# EAGLE design pj7 (EAGLE 7.3.2)
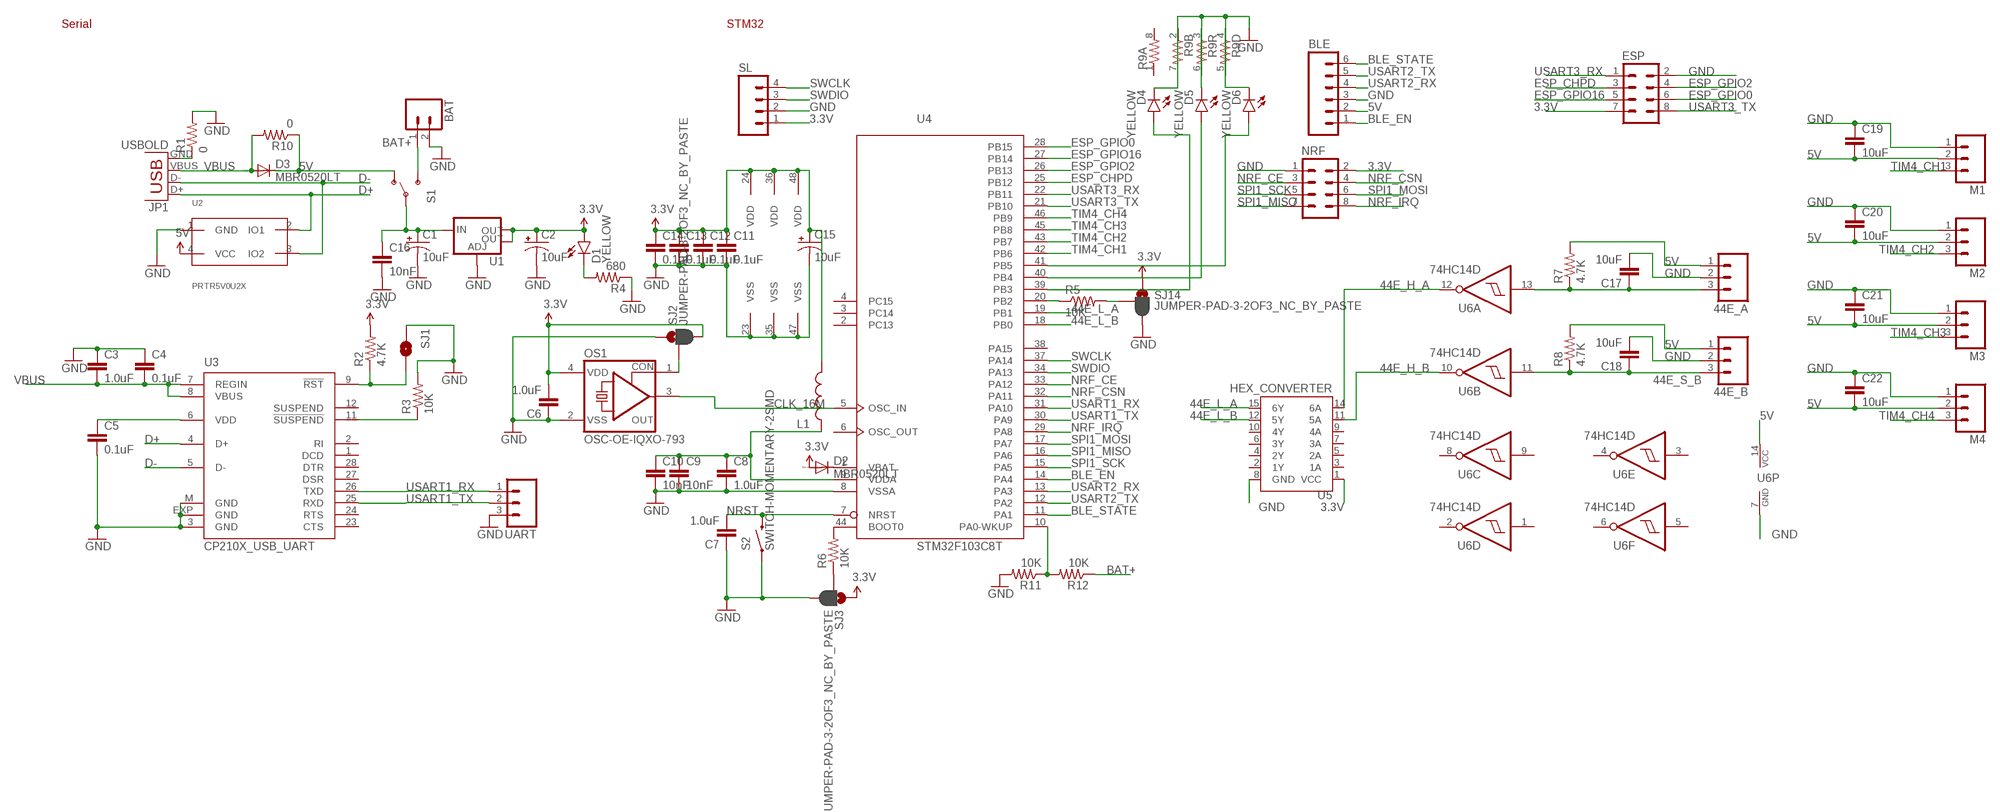
[diagram p0: schematic, sheet 1]

## Parts
44E_A  M03LOCK  [1X03_LOCK]
44E_B  M03LOCK  [1X03_LOCK]
BAT  M02LOCK  [1X02_LOCK]
BLE  M06LOCK  [1X06_LOCK]
C1  10uF  10UF-16V-10%(TANT)  [EIA3216]
C2  10uF  10UF-16V-10%(TANT)  [EIA3216]
C3  1.0uF  1.0UF-16V-10%(0603)  [0603-CAP]
C4  0.1uF  0.1UF-25V-5%(0603)  [0603-CAP]
C5  0.1uF  0.1UF-25V-5%(0603)  [0603-CAP]
C6  1.0uF  1.0UF-16V-10%(0603)  [0603-CAP]
C7  1.0uF  1.0UF-16V-10%(0603)  [0603-CAP]
C8  1.0uF  1.0UF-16V-10%(0603)  [0603-CAP]
C9  10nF  10NF/10000PF-50V-10%(0603)  [0603-CAP]
C10  10nF  10NF/10000PF-50V-10%(0603)  [0603-CAP]
C11  0.1uF  0.1UF-25V-5%(0603)  [0603-CAP]
C12  0.1uF  0.1UF-25V-5%(0603)  [0603-CAP]
C13  0.1uF  0.1UF-25V-5%(0603)  [0603-CAP]
C14  0.1uF  0.1UF-25V-5%(0603)  [0603-CAP]
C15  10uF  10UF-16V-10%(TANT)  [EIA3216]
C16  10nF  10NF/10000PF-50V-10%(0603)  [0603-CAP]
C17  10uF  10UF-6.3V-20%(0603)  [0603-CAP]
C18  10uF  10UF-6.3V-20%(0603)  [0603-CAP]
C19  10uF  10UF-6.3V-20%(0603)  [0603-CAP]
C20  10uF  10UF-6.3V-20%(0603)  [0603-CAP]
C21  10uF  10UF-6.3V-20%(0603)  [0603-CAP]
C22  10uF  10UF-6.3V-20%(0603)  [0603-CAP]
D1  YELLOW  LED-YELLOW1206  [LED-1206]
D2  MBR0520LT  [SOD123]
D3  MBR0520LT  [SOD123]
D4  YELLOW  LED-YELLOW1206  [LED-1206]
D5  YELLOW  LED-YELLOW1206  [LED-1206]
D6  YELLOW  LED-YELLOW1206  [LED-1206]
ESP  M04X2DIP  [2X4]
JP1  USBOLD  [USB-MINIB-OLD]
L1  INDUCTOR0603  [0603]
M1  M03LOCK  [1X03_LOCK]
M2  M03LOCK  [1X03_LOCK]
M3  M03LOCK  [1X03_LOCK]
M4  M03LOCK  [1X03_LOCK]
NRF  M04X2DIP  [2X4]
OS1  OSC-OE-IQXO-793  [2.5X2-4-PAD]
R1  0  0OHM-1/10W-5%(0603)  [0603]
R2  4.7K  4.7KOHM-1/10W-1%(0603)  [0603-RES]
R3  10K  4.7KOHM-1/10W-1%(0603)  [0603-RES]
R4  680  680OHM1/10W5%(0603)  [0603-RES]
R5  10K  10KOHM-1/10W-1%(0603)0603  [0603-RES]
R6  10K  10KOHM-1/10W-1%(0603)0603  [0603-RES]
R7  4.7K  4.7KOHM-1/10W-1%(0603)  [0603-RES]
R8  4.7K  4.7KOHM-1/10W-1%(0603)  [0603-RES]
R9  RESISTOR-ARRAY0603-ARV  [0603-ARV]
R10  0  0OHM-1/10W-5%(0603)  [0603]
R11  10K  10KOHM-1/10W-1%(0603)0603  [0603-RES]
R12  10K  10KOHM-1/10W-1%(0603)0603  [0603-RES]
S1  SWITCH-SPDTSMD  [AYZ0202]
S2  SWITCH-MOMENTARY-2SMD  [TACTILE-SWITCH-SMD]
SJ1  JUMPER-PAD-2-NOYES_SILK  [PAD-JUMPER-2-NO_YES_SILK]
SJ2  JUMPER-PAD-3-2OF3_NC_BY_PASTE  [PAD-JUMPER-3-2OF3_NC_BY_PASTE_YES_SILK_FULL_BOX]
SJ3  JUMPER-PAD-3-2OF3_NC_BY_PASTE  [PAD-JUMPER-3-2OF3_NC_BY_PASTE_YES_SILK_FULL_BOX]
SJ14  JUMPER-PAD-3-2OF3_NC_BY_PASTE  [PAD-JUMPER-3-2OF3_NC_BY_PASTE_YES_SILK_FULL_BOX]
SL  M04LOCK  [1X04_LOCK]
U1  V_REG_LM1117SOT223  [SOT223]
U2  PRTR5V0U2X  [SOT143]
U3  CP210X_USB_UART  [MLP28]
U4  STM32F103C8T  [LQFP48]
U5  HEX_CONVERTER  [SO016]
U6  74HC14D  [SO14]
UART  M03LOCK  [1X03_LOCK]

## Nets
3.3V: C2.A(+) C6.2 C11.1 C12.1 C13.1 C14.1 C15.A(+) D1.A D2.A ESP.7 L1.2 NRF.2 OS1.4(VDD) R2.2 SJ2.3 SJ3.1 SJ14.1 SL.1 U1.2(OUT) U1.4(OUT) U4.24(VDD) U4.36(VDD) U4.48(VDD) U5.1(VCC)
5V: 44E_A.1 44E_B.1 BLE.2 C19.2 C20.2 C21.2 C22.2 D3.C M1.2 M2.2 M3.2 M4.2 R7.2 R8.2 R10.1 S1.1(O) U2.4(VCC) U6.14(P:VCC)
44E_H_A: U5.14(6A) U6.12(A:O)
44E_H_B: U5.11(5A) U6.10(B:O)
44E_L_A: U4.19(PB1) U5.15(6Y)
44E_L_B: U4.18(PB0) U5.12(5Y)
44E_S_B: 44E_B.3 C18.1 R8.1 U6.11(B:I)
BAT+: BAT.1 R12.1 S1.3(S)
BLE_EN: BLE.1 U4.14(PA4)
BLE_STATE: BLE.6 U4.11(PA1)
CLK_16M: OS1.3(OUT) U4.5(OSC_IN)
D+: JP1.D+ U2.2(IO1) U3.4(D+)
D-: JP1.D- U2.3(IO2) U3.5(D-)
ESP_CHPD: ESP.3 U4.25(PB12)
ESP_GPIO0: ESP.6 U4.28(PB15)
ESP_GPIO2: ESP.4 U4.26(PB13)
ESP_GPIO16: ESP.5 U4.27(PB14)
GND: 44E_A.2 44E_B.2 BAT.2 BLE.3 C1.C(-) C2.C(-) C3.1 C4.1 C5.2 C6.1 C7.1 C8.2 C9.2 C10.2 C11.2 C12.2 C13.2 C14.2 C15.C(-) C16.2 C17.2 C18.2 C19.1 C20.1 C21.1 C22.1 ESP.2 M1.1 M2.1 M3.1 M4.1 NRF.1 OS1.2(VSS) R1.2 R3.2 R4.1 R9.5 R9.6 R9.7 R11.2 S2.1 SJ1.2 SJ2.1 SJ3.3 SJ14.3 SL.2 U1.1(ADJ) U2.1(GND) U3.3(GND) U3.EXP(GND) U3.M(GND) U4.8(VSSA) U4.23(VSS) U4.35(VSS) U4.47(VSS) U5.8(GND) U6.7(P:GND) UART.3
N$1: JP1.GND R1.1
N$2: R3.1 U3.11(!SUSPEND)
N$3: D1.C R4.2
N$4: D2.C U4.1(VBAT)
N$5: R11.1 R12.2 U4.10(PA0-WKUP)
N$6: C8.1 C9.1 C10.1 L1.1 U4.9(VDDA)
N$7: R6.2 U4.44(BOOT0)
N$8: D6.A U4.41(PB5)
N$9: R6.1 SJ3.2
N$10: R2.1 SJ1.1 U3.9(!RST)
N$11: OS1.1(CON) SJ2.2
N$13: D5.A U4.40(PB4)
N$14: 44E_A.3 C17.1 R7.1 U6.13(A:I)
N$15: C5.1 U3.6(VDD)
N$16: D4.A U4.39(PB3)
N$17: D4.C R9.2
N$18: D5.C R9.3
N$19: D6.C R9.4
N$20: C1.A(+) C16.1 S1.2(P) U1.3(IN)
N$48: R5.2 SJ14.2
NRF_CE: NRF.3 U4.33(PA12)
NRF_CSN: NRF.4 U4.32(PA11)
NRF_IRQ: NRF.8 U4.29(PA8)
NRST: C7.2 S2.3 U4.7(NRST)
OURET: R5.1 U4.20(PB2)
SPI1_MISO: NRF.7 U4.16(PA6)
SPI1_MOSI: NRF.6 U4.17(PA7)
SPI1_SCK: NRF.5 U4.15(PA5)
SWCLK: SL.4 U4.37(PA14)
SWDIO: SL.3 U4.34(PA13)
TIM4_CH1: M1.3 U4.42(PB6)
TIM4_CH2: M2.3 U4.43(PB7)
TIM4_CH3: M3.3 U4.45(PB8)
TIM4_CH4: M4.3 U4.46(PB9)
USART1_RX: U3.26(TXD) U4.31(PA10) UART.1
USART1_TX: U3.25(RXD) U4.30(PA9) UART.2
USART2_RX: BLE.4 U4.13(PA3)
USART2_TX: BLE.5 U4.12(PA2)
USART3_RX: ESP.1 U4.22(PB11)
USART3_TX: ESP.8 U4.21(PB10)
VBUS: C3.2 C4.2 D3.A JP1.VBUS R10.2 U3.7(REGIN) U3.8(VBUS)
Unconnected: R9.1 R9.8 U3.1(DCD) U3.2(RI) U3.12(SUSPEND) U3.23(CTS) U3.24(RTS) U3.27(DSR) U3.28(DTR) U4.2(PC13) U4.3(PC14) U4.4(PC15) U4.6(OSC_OUT) U4.38(PA15) U5.2(1Y) U5.3(1A) U5.4(2Y) U5.5(2A) U5.6(3Y) U5.7(3A) U5.9(4A) U5.10(4Y) U6.1(D:I) U6.2(D:O) U6.3(E:I) U6.4(E:O) U6.5(F:I) U6.6(F:O) U6.8(C:O) U6.9(C:I)

## Notes on the sheet
- Serial | STM32

## Library data of the parts
44E_A 44E_B M1-M4 UART = SparkFun-Connectors:M03: Header 3 Standard 3-pin 0.1" header. Use with straight break away headers (SKU : PRT-00116), right angle break away headers (PRT-00553), swiss pins (PRT-00743), machine pins (PRT-00117), and female headers (PRT-00115). Molex polarized connector foot print use with SKU : PRT-08232 with associated crimp pins and housings.
BAT = SparkFun-Connectors:M02: Standard 2-pin 0.1" header. Use with - straight break away headers ( PRT-00116) - right angle break away headers (PRT-00553) - swiss pins (PRT-00743) - machine pins (PRT-00117) - female headers (PRT-00115) Molex polarized connector foot print use with: PRT-08233 with associated crimp pins and housings. 2.54_SCREWTERM for use with PRT-10571. 3.5mm Screw Terminal footprints for PRT-08084 5mm Screw Terminal footprints for use with PRT-08432
BLE = SparkFun-Connectors:M06: Header 6 Standard 6-pin 0.1" header. Use with straight break away headers (SKU : PRT-00116), right angle break away headers (PRT-00553), swiss pins (PRT-00743), machine pins (PRT-00117), and female headers (PRT-00115). Molex polarized connector foot print use with SKU : PRT-08094 with associated crimp pins and housings. NOTES ON THE VARIANTS LOCK and LOCK_LONGPADS... This footprint was designed to help hold the alignment of a through-hole component (i.e. 6-pin header) while soldering it into place. You may notice that each hole has been shifted either up or down by 0.005 of an inch from it's more standard position (which is a perfectly straight line). This slight alteration caused the pins (the squares in the middle) to touch the edges of the holes. Because they are alternating, it causes a "brace" to hold the component in place. 0.005 has proven to be the perfect amount of "off-center" position when using our standard breakaway headers. Although looks a little odd when you look at the bare footprint, once you have a header in there, the alteration is very hard to notice. Also,if you push a header all the way into place, it is covered up entirely on the bottom side. This idea of altering the position of holes to aid alignment will be further integrated into the Sparkfun Library for other footprints. It can help hold any component with 3 or more connection pins.
C1 C2 C15 = SparkFun-Capacitors:10UF-16V-10%(TANT): CAP-00811 1206/EIA-3216 Tantalum capacitor; PROD_ID: CAP-00811
C3 C6-C8 = SparkFun-Capacitors:1.0UF-16V-10%(0603): CAP-00868; PROD_ID: CAP-00868
C4 C5 C11-C14 = SparkFun-Capacitors:0.1UF-25V-5%(0603): CAP-08604; PROD_ID: CAP-08604
C9 C10 C16 = SparkFun-Capacitors:10NF/10000PF-50V-10%(0603): CAP-00867; PROD_ID: CAP-00867
C17-C22 = SparkFun-Capacitors:10UF-6.3V-20%(0603): CAP-11015; PROD_ID: CAP-11015
D1 D4-D6 = SparkFun-LED:LED-YELLOW: Yellow SMD LEDs LilyPad 1206- DIO-09909 0603- DIO-09003 "SMART" means more efficient and expensive; PROD_ID: DIO-00820
D2 D3 = diode:MBR0520LT: SCHOTTKY BARRIER RECTIFIER Source: http://onsemi.com .. MBR0520LT1-D.pdf
ESP NRF = SparkFun-Connectors:M04X2: .1" header, two rows of four.
JP1 = SparkFun-Connectors:USB: USB Connectors USB-B-PTH is fully proven SKU : PRT-00139/CONN-08278 USB-miniB is fully proven SKU : PRT-00587 USB-A-PCB is untested. USB-A-H is throughly reviewed, but untested. Spark Fun Electronics SKU : PRT-00437 USB-B-SMT is throughly reviewed, but untested. Needs silkscreen touching up. USB-A-S has not been used/tested USB-MB-H has not been used/tested USB-MICROB has been used. CONN-09505
L1 = SparkFun-Passives:INDUCTOR: Inductors Basic Inductor/Choke - 0603 and 1206. Footprints are not proven and vary greatly between part numbers. INDUCTOR POWER 3.3UH 4.0A SMD 0.197" L x 0.197" W x 0.177" H (5.00mm x 5.00mm x 4.50mm)
OS1 = IQD-Frequency-Products:OSC-OE: OSCILLATOR WITH OE
R1 R10 = SparkFun-Resistors:0OHM-1/10W-5%(0603): RES-08609; PROD_ID: RES-08609
R2 R7 R8 = SparkFun-Resistors:4.7KOHM-1/10W-1%(0603): RES-07857; PROD_ID: RES-07857
R3 = SparkFun-Resistors:4.7KOHM-1/10W-1%(0603): RES-07857; PROD_ID: RES-07857; VALUE: 4.7K
R4 = SparkFun-Resistors:680OHM1/10W5%(0603): RES-09333; PROD_ID: RES-09333
R5 R6 R11 R12 = SparkFun-Resistors:10KOHM-1/10W-1%(0603): RES-00824; PROD_ID: RES-00824
R9 = SparkFun-Resistors:RESISTOR-ARRAY: Array Chip Resistor Source: RS Component / Phycomp
S1 = SparkFun-Electromechanical:SWITCH-SPDT: SPDT Switch Simple slide switch, Spark Fun Electronics SKU : COM-00102 DPDT SMT slide switch, AYZ0202, SWCH-08179; PROD_ID: SWCH-08179; SF_ID: COM-00597
S2 = SparkFun-Electromechanical:SWITCH-MOMENTARY-2: Various NO switches- pushbuttons, reed, etc; PROD_ID: SWCH-08247
SJ1 = SparkFun-Passives:JUMPER-PAD-2-NO
SJ2 SJ3 SJ14 = SparkFun-Passives:JUMPER-PAD-3-2OF3_NC_BY_PASTE
SL = SparkFun-Connectors:M04: Header 4 Standard 4-pin 0.1" header. Use with straight break away headers (SKU : PRT-00116), right angle break away headers (PRT-00553), swiss pins (PRT-00743), machine pins (PRT-00117), and female headers (PRT-00115). Molex polarized connector foot print use with SKU : PRT-08231 with associated crimp pins and housings. 1MM SMD Version SKU: PRT-10208
U1 = SparkFun-PowerIC:V_REG_LM1117: Voltage Regulator LM1117 Standard adjustable voltage regulator but in SMD form. Spark Fun Electronics SKU : COM-00595; PROD_ID: VREG-08170
U2 = semicon-smd-ipc:PRTR5V0U2X
U3 = SparkFun-DigitalIC:CP210X_USB_UART: Single-Chip USB to UART Bridge Source: www.silabs.com .. CP2101.pdf / cp2102.pdf. Spark Fun Electronics SKU : COM-00310
U4 = micro-stm_v3:STM32F103C*T: ARM 32-bit Cortex™-M3 CPU 72 MHz maximum frequency 16 to 128 Kbytes of Flash memory 6 to 20 kbytes of SRAM 37 GPIOs 2.0 to 3.6 V application supply
U5 = SparkFun-DigitalIC:HEX_CONVERTER: 74HC4050 Hex Buffer Level Shifter SMD SO016; PROD_ID: IC-09604
U6 = 74xx-eu:74*14: Hex schmitt trigger INVERTER

## Board
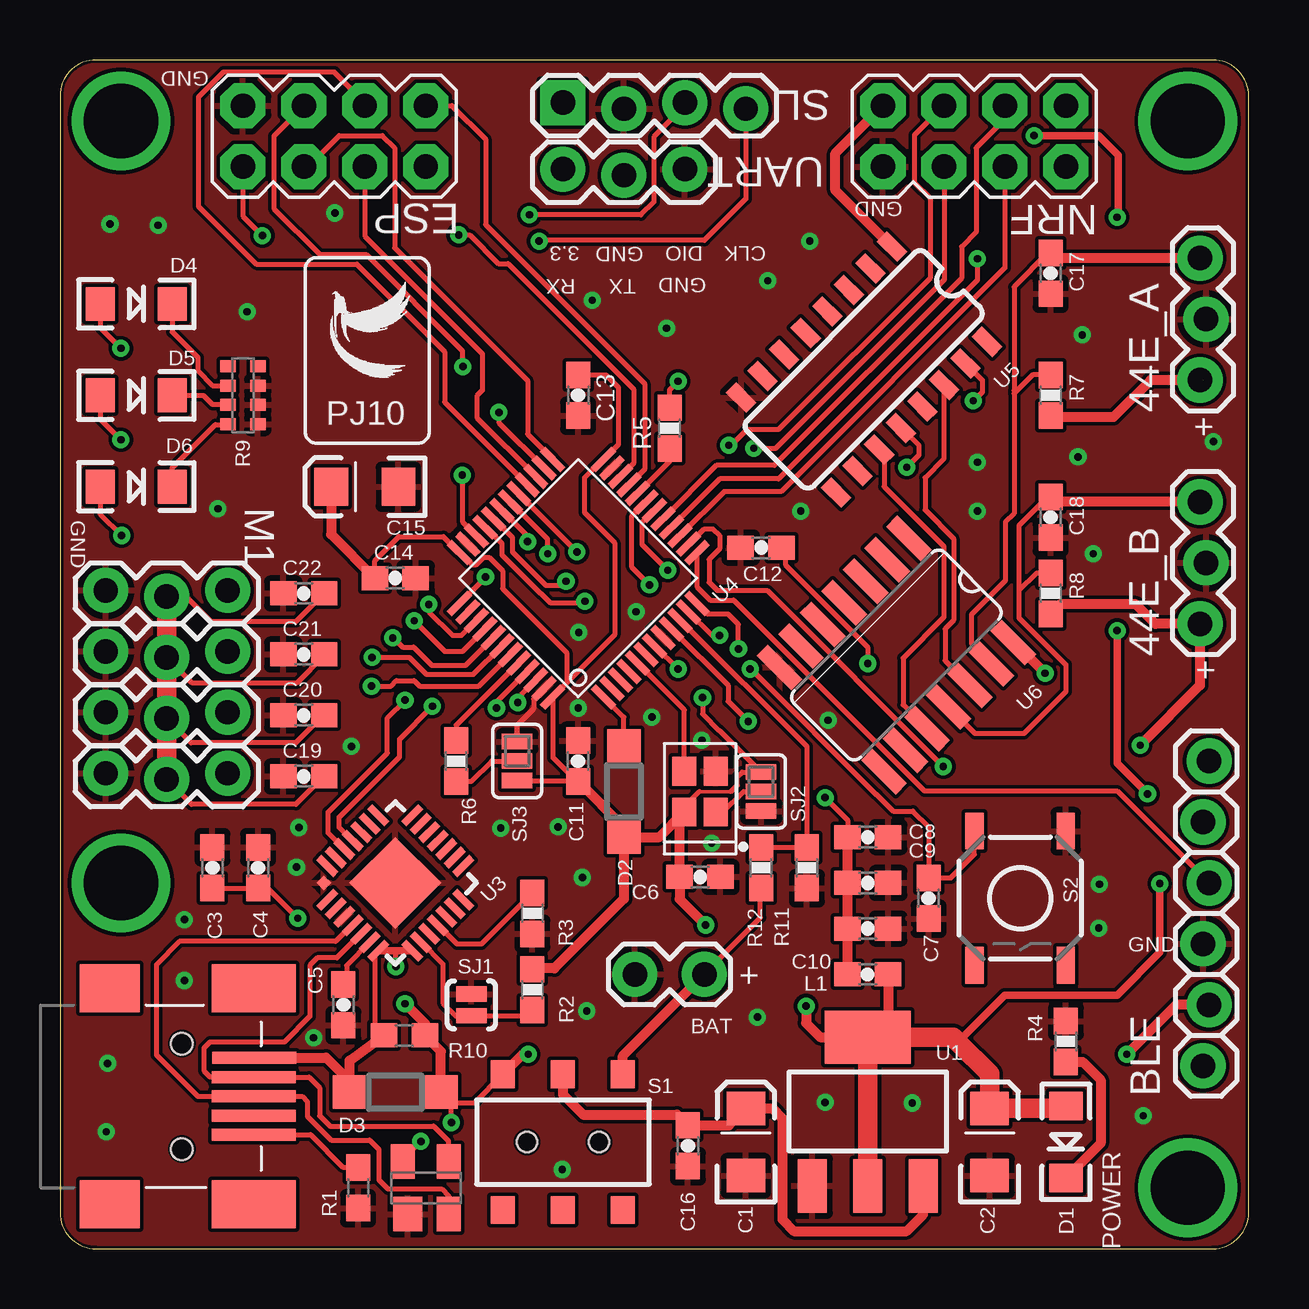
[diagram p1: board, top side]
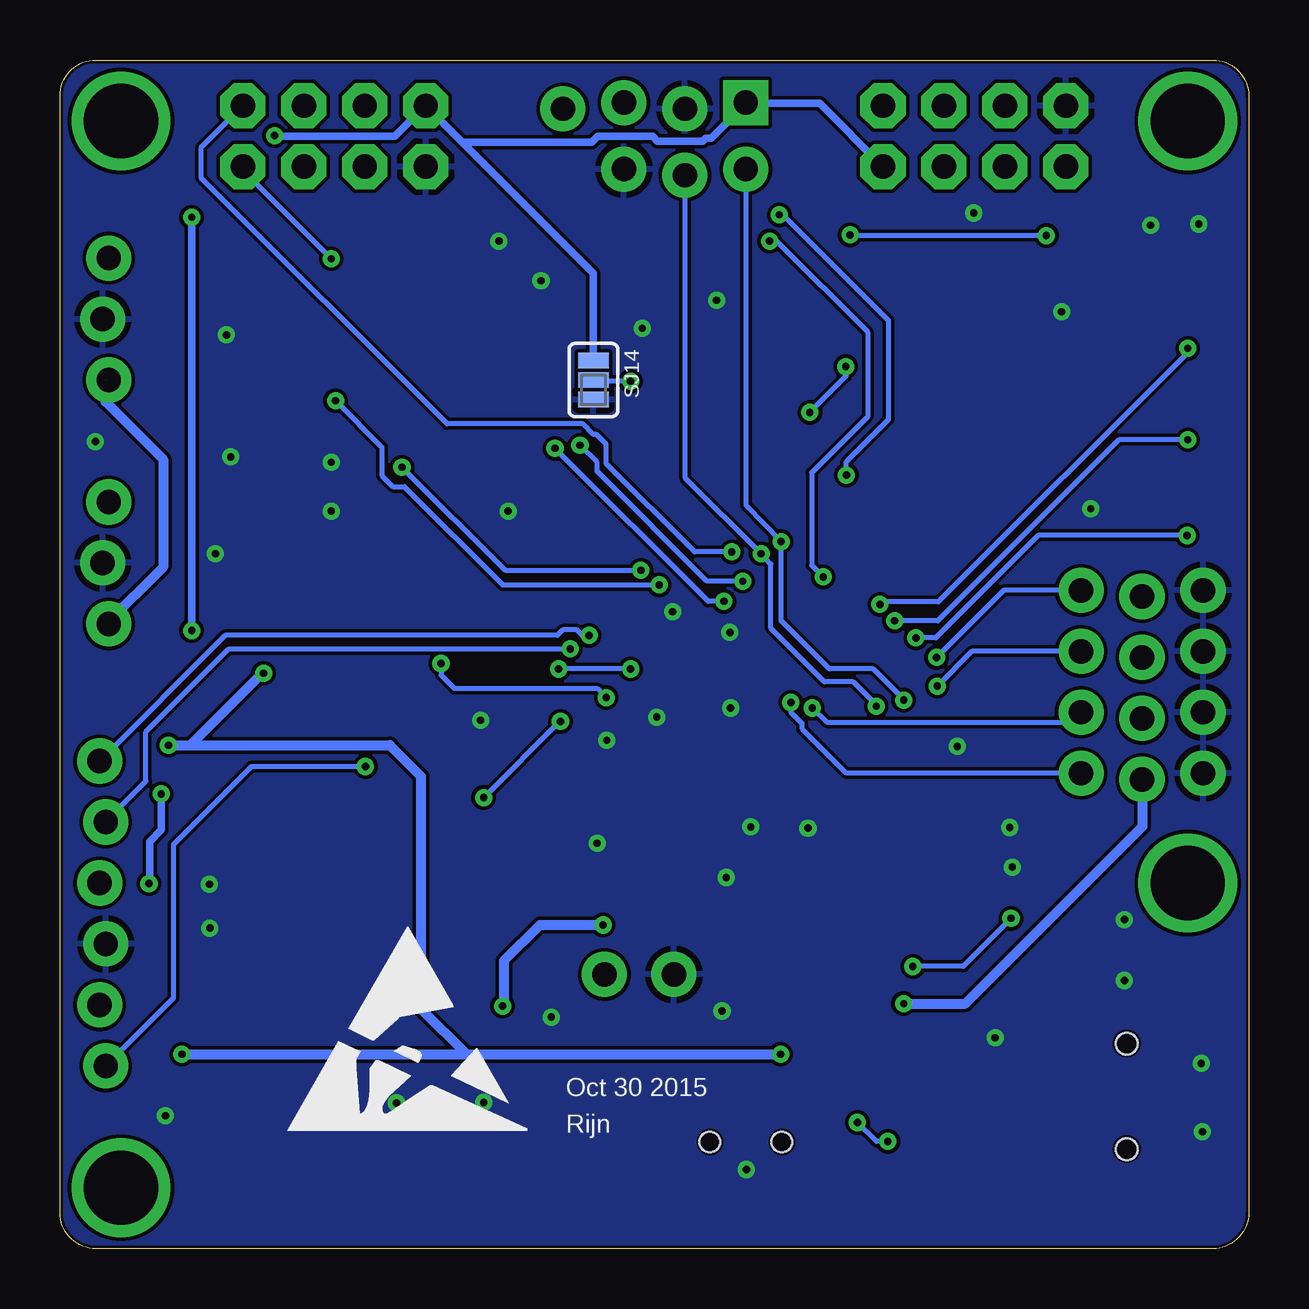
[diagram p2: board, bottom side, seen from below]

Size 49.53 x 49.53 mm. Coordinates in mm from the lower left corner, seen from the top.
Outline: 0,48.03 0,1.5 arc90 1.5,0 48.03,0 arc90 49.53,1.5 49.53,48.03 arc90 48.03,49.53 1.5,49.53 arc90 0,48.03
Copper layers (1*16): Top 0.035mm / dielectric 1.5mm / Bottom 0.035mm
Design rules "default *": minimum track width 6mil, minimum drill 12mil, track to track 6mil, track to pad 6mil, pad to pad 6mil, via to via 6mil, smd to smd 6mil, copper to edge 5mil, drill to drill 6mil, minimum pad ring 10mil, minimum via ring 8mil, stop-mask expansion 0mil, vias tented up to drill 15mil, thermal gap 10mil

### Footprints (pad centres in the part's own frame; a part is rotated, then mirrored left to right if it is on the bottom)
1X03_LOCK = drill 1.016 pad 1.88: 1 0,0.127; 2 2.54,-0.127; 3 5.08,0.127
1X02_LOCK = drill 1.016 pad 1.88: 1 -0.178,0; 2 2.718,0
1X06_LOCK = drill 1.016 pad 1.88: 1 0,0; 2 2.54,-0.254; 3 5.08,0; 4 7.62,-0.254; 5 10.16,0; 6 12.7,-0.254
EIA3216 = smd 1.4 x 1.6: A 1.4,0; C -1.4,0
0603-CAP = smd 1.1 x 1: 1 -0.85,0; 2 0.85,0
LED-1206 = smd 1.2 x 1.4: A -1.5,0; C 1.5,0
SOD123 = smd 1.4 x 1.4: A 1.9,0; C -1.9,0
2X4 = drill 1.016 pad 1.88 octagon: 1 -3.81,-1.27; 2 -3.81,1.27; 3 -1.27,-1.27; 4 -1.27,1.27; 5 1.27,-1.27; 6 1.27,1.27; 7 3.81,-1.27; 8 3.81,1.27
USB-MINIB-OLD = smd 2.5 x 2: 1 -3,-4.5; 2 -3,4.5 | smd 3.5 x 2: 3 3,-4.5; 4 3,4.5 | smd 3.5 x 0.5: D+ 3,0; D- 3,0.8; GND 3,-1.6; ID 3,-0.8; VBUS 3.01,1.61 | hole 0.9: 0,2.2; 0,-2.2
0603 = smd 1.1 x 1: 1 -0.85,0; 2 0.85,0
2.5X2-4-PAD = smd 1.2 x 1: 1 -0.85,-0.65; 2 0.85,-0.65; 3 0.85,0.65; 4 -0.85,0.65
0603-RES = smd 1.1 x 1: 1 -0.85,0; 2 0.85,0
0603-ARV = smd 0.5 x 0.65: 1 -1.2,-0.625; 2 -0.4,-0.625; 3 0.4,-0.625; 4 1.2,-0.625; 5 1.2,0.625; 6 0.4,0.625; 7 -0.4,0.625; 8 -1.2,0.625
AYZ0202 = smd 1 x 1.15: 1 -2.5,2.825; 2 0,2.825; 3 2.5,2.825; 4 -2.5,-2.825; 5 0,-2.825; 6 2.5,-2.825 | hole 0.85: 1.5,0; -1.5,0
TACTILE-SWITCH-SMD = smd 1.524 x 0.762: 1 -2.794,1.905; 2 2.794,1.905; 3 -2.794,-1.905; 4 2.794,-1.905
PAD-JUMPER-2-NO_YES_SILK = smd 0.635 x 1.27: 1 -0.45,0; 2 0.45,0
PAD-JUMPER-3-2OF3_NC_BY_PASTE_YES_SILK_FULL_BOX = smd 0.635 x 1.27: 1 -0.813,0; 2 0,0; 3 0.813,0
1X04_LOCK = drill 1.016 pad 1.88 square: 1 0,0.127 | drill 1.016 pad 1.88: 2 2.54,-0.127; 3 5.08,0.127; 4 7.62,-0.127
SOT223 = smd 1.219 x 2.235: 1 -2.311,-3.099; 2 0,-3.099; 3 2.311,-3.099 | smd 3.6 x 2.2: 4 0,3.099
SOT143 = smd 1.2 x 1.44: 1 -0.75,-1.1 | smd 1 x 1.44: 2 0.95,-1.1; 3 0.95,1.1; 4 -0.95,1.1
MLP28 = smd 1 x 0.3: 1 -2.5,1.5; 2 -2.5,1; 3 -2.5,0.5; 4 -2.5,0; 5 -2.5,-0.5; 6 -2.5,-1; 7 -2.5,-1.5; 15 2.5,-1.5; 16 2.5,-1; 17 2.5,-0.5; 18 2.5,0; 19 2.5,0.5; 20 2.5,1; 21 2.5,1.5 | smd 0.3 x 1: 8 -1.5,-2.5; 9 -1,-2.5; 10 -0.5,-2.5; 11 0,-2.5; 12 0.5,-2.5; 13 1,-2.5; 14 1.5,-2.5; 22 1.5,2.5; 23 1,2.5; 24 0.5,2.5; 25 0,2.5; 26 -0.5,2.5; 27 -1,2.5; 28 -1.5,2.5 | smd 2.7 x 2.7: EXP 0,0 | smd 0.435 x 0.435: M -2.103,2.103
LQFP48 = smd 0.3 x 1.2: 1 -2.75,-4.25; 2 -2.25,-4.25; 3 -1.75,-4.25; 4 -1.25,-4.25; 5 -0.75,-4.25; 6 -0.25,-4.25; 7 0.25,-4.25; 8 0.75,-4.25; 9 1.25,-4.25; 10 1.75,-4.25; 11 2.25,-4.25; 12 2.75,-4.25; 25 2.75,4.25; 26 2.25,4.25; 27 1.75,4.25; 28 1.25,4.25; 29 0.75,4.25; 30 0.25,4.25; 31 -0.25,4.25; 32 -0.75,4.25; 33 -1.25,4.25; 34 -1.75,4.25; 35 -2.25,4.25; 36 -2.75,4.25 | smd 1.2 x 0.3: 13 4.25,-2.75; 14 4.25,-2.25; 15 4.25,-1.75; 16 4.25,-1.25; 17 4.25,-0.75; 18 4.25,-0.25; 19 4.25,0.25; 20 4.25,0.75; 21 4.25,1.25; 22 4.25,1.75; 23 4.25,2.25; 24 4.25,2.75; 37 -4.25,2.75; 38 -4.25,2.25; 39 -4.25,1.75; 40 -4.25,1.25; 41 -4.25,0.75; 42 -4.25,0.25; 43 -4.25,-0.25; 44 -4.25,-0.75; 45 -4.25,-1.25; 46 -4.25,-1.75; 47 -4.25,-2.25; 48 -4.25,-2.75
SO016 = smd 0.6 x 1.2: 1 -4.445,-2.8; 2 -3.175,-2.8; 3 -1.905,-2.8; 4 -0.635,-2.8; 5 0.635,-2.8; 6 1.905,-2.8; 7 3.175,-2.8; 8 4.445,-2.8; 9 4.445,2.8; 10 3.175,2.8; 11 1.905,2.8; 12 0.635,2.8; 13 -0.635,2.8; 14 -1.905,2.8; 15 -3.175,2.8; 16 -4.445,2.8
SO14 = smd 0.66 x 2.032: 1 -3.81,-3.073; 2 -2.54,-3.073; 3 -1.27,-3.073; 4 0,-3.073; 5 1.27,-3.073; 6 2.54,-3.073; 7 3.81,-3.073; 8 3.81,3.073; 9 2.54,3.073; 10 1.27,3.073; 11 0,3.073; 12 -1.27,3.073; 13 -2.54,3.073; 14 -3.81,3.073

### Placement (x,y rotation side)
44E_A  47.62,36.2 90 top
44E_B  47.62,26.04 90 top
BAT  26.67,11.43 180 top
BLE  47.62,7.62 90 top
C1  28.57,4.45 90 top
C2  38.73,4.45 90 top
C3  6.35,15.88 270 top
C4  8.26,15.88 270 top
C5  11.81,10.16 270 top
C6  26.67,15.49 180 top
C7  36.2,14.61 90 top
C8  33.66,17.14 0 top
C9  33.66,15.24 0 top
C10  33.66,13.34 0 top
C11  21.59,20.32 90 top
C12  29.21,29.21 180 top
C13  21.59,35.56 270 top
C14  13.97,27.94 0 top
C15  12.7,31.75 180 top
C16  26.16,4.29 270 top
C17  41.27,40.64 270 top
C18  41.27,30.48 270 top
C19  10.16,19.68 0 top
C20  10.16,22.23 0 top
C21  10.16,24.77 0 top
C22  10.16,27.3 0 top
D1  41.91,4.45 270 top
D2  23.5,19.05 270 top
D3  13.97,6.53 180 top
D4  3.17,39.37 0 top
D5  3.17,35.56 0 top
D6  3.17,31.75 0 top
ESP  11.43,46.35 0 top
JP1  5.08,6.35 0 top
L1  33.66,11.43 0 top
M1  1.91,27.3 0 top
M2  1.91,24.77 0 top
M3  1.91,22.23 0 top
M4  1.91,19.68 0 top
NRF  38.1,46.35 0 top
OS1  26.67,19.05 90 top
R1  12.42,2.54 270 top
R2  19.68,10.79 90 top
R3  19.68,13.97 270 top
R4  41.91,8.64 270 top
R5  25.4,34.19 90 top
R6  16.51,20.32 90 top
R7  41.27,35.56 270 top
R8  41.27,27.3 270 top
R9  7.62,35.56 270 top
R10  14.35,8.89 180 top
R11  31.11,15.88 270 top
R12  29.21,15.88 90 top
S1  20.95,4.45 0 top
S2  40.01,14.61 270 top
SJ1  17.14,10.16 90 top
SJ2  29.21,19.05 90 top
SJ3  19.05,20.32 90 top
SJ14  27.3,36.2 270 bottom
SL  20.95,47.62 0 top
U1  33.66,5.71 0 top
U2  15.24,2.54 0 top
U3  13.97,15.24 45 top
U4  21.59,27.94 45 top
U5  33.5,36.63 225 top
U6  34.85,24.74 225 top
U$1  [LOGO]  11.25,36.27 0 top
U$2  [ESD_10.00]  40.13,4.83 0 bottom
UART  20.95,44.86 0 top

### Tracks (layer width: path | path; a pad name or v marks a point on that pad's centre or on a via)
3.3V  (via drill 0.3)
  Top 0.152: 26.64,19.05 27.94,19.05
  Top 0.203: U4.48 20.55,22.97 20.55,20.45 21.53,19.47 C11.1 19.09,19.47 SJ3.1 | C14.1 13.12,28.66 14.12,29.67 15.97,29.67 U4.36 16.67,29 17.17,28.5 17.35,28.5 17.65,28.8 17.88,28.8 18.44,28.25 18.44,27.51 21.11,24.84 21.11,23.57 U4.48 | C13.1 22.75,36.41 23.27,35.89 23.27,33.51 U4.24 22.6,32.89 21.84,32.13 21.84,30.68 23.11,29.41 23.11,25.57 U4.48 | OS1.4 26.02,18.4 26.64,19.05 | 27.94,19.05 28.22,19.3 28.22,19.66 28.42,19.86 SJ2.3 27.48,21.59 27.46,21.59 26.77,22.28 v26.77,22.96 | C12.1 30.15,29.21 30.23,29.13 30.23,28.5 33.66,25.07 v33.66,24.38
  Top 0.305: v40.59,46.38 43.28,46.38 44.09,45.57 44.09,43.03 v44.04,42.98 | v44.04,25.76 44.04,20.22 v45.31,18.95 | v45.82,15.21 45.82,12.34 44.04,10.57 39.37,10.57 37.41,8.61
  Top 0.406: L1.2 34.51,9.66 U1.4 | v26.9,13.49 25.82,14.57 C6.2 25.82,18 OS1.4 24.97,17.15 D2.A | v31.09,10.11 31.09,9.4 31.67,8.81 U1.4 | U1.4 | D2.A 23.5,17.57 C11.1 | D2.A 23.5,14.58 20.6,11.68 19.72,11.68 R2.2 | C15.A 11.3,29.76 C14.1 | U5.1 34.65,41.75 32.31,44.09 32.31,45.64 NRF.2
  Top 0.813: U1.4 U1.2 | U1.4 37.21,8.81 37.41,8.61 38.73,7.29 C2.A 41.81,5.84 D1.A | U1.4
  Bottom 0.203: v33.66,24.38 33.66,23.9 33.1,23.34 27.15,23.34 v26.77,22.96
  Bottom 0.305: SL.1 20.95,47.73 | 20.95,47.73 22.4,46.28 22.63,46.28 22.76,46.15 24.64,46.15 24.84,46.35 27.13,46.35 27.38,46.1 32.77,46.1 | 32.77,46.1 34.27,47.6 | 20.95,47.73 17.88,47.73 ESP.7 | 34.27,47.6 34.34,47.6 35.59,46.35 40.56,46.35 v40.59,46.38 | v44.04,42.98 v44.04,25.76 | v45.31,18.95 45.31,17.45 45.8,16.97 45.8,15.24 v45.82,15.21 | SJ14.1 27.3,40.64 32.77,46.1 | 34.27,47.6 NRF.2
  Bottom 0.406: v26.9,13.49 29.54,13.49 31.04,11.99 31.04,10.16 v31.09,10.11
5V  (via drill 0.3)  (1 unrouted)
  Top 0.203: U2.4 14.29,3.72 v15.04,4.47 | 16.31,5.91 D3.C 16.31,6.09 | M1.2 5.23,27.18 6.27,26.14 9.84,26.14 C22.2 | C21.2 11.01,24.73 9.86,23.57 5.51,23.57 M2.2 | C20.2 10.97,22.23 9.83,21.08 5.46,21.08 M3.2 | C19.2 11,19.68 9.83,18.52 5.49,18.52 M4.2 | U6.14 | 47.62,36.2 44E_A.1 | v16.31,5.26 16.31,6.09 | 16.31,6.09 17.28,6.09 S1.1
  Top 0.406: D3.C 15.87,8.22 R10.1 15.2,9.39 v14.38,10.21 | 44E_A.1 45.44,36.2 43.89,34.65 41.34,34.65 R7.2 | BLE.2 46.51,10.16 v44.45,8.1 | v19.51,8.1 19.29,8.1 S1.1 | v45.01,20.98 47.5,23.47 44E_B.1 45.64,26.04 44.83,26.85 41.67,26.85 R8.2 | U6.14 39.76,25.26 v41.05,23.98
  Top 0.813: M4.2 M3.2 M2.2 M1.2
  Bottom 0.203: v15.04,4.47 15.52,4.47 v16.31,5.26 | 47.6,26.04 44E_B.1
  Bottom 0.406: v14.38,10.21 11.81,10.21 4.42,17.6 4.42,19.53 M4.2 | v44.45,8.1 32.59,8.1 | 32.59,8.1 v19.51,8.1 | v45.01,20.98 44.09,20.98 | 44.09,20.98 35.79,20.98 34.49,19.68 34.49,10.01 32.59,8.1 | 47.62,36.2 47.62,35.28 45.24,32.89 45.24,28.4 47.6,26.04 | v41.05,23.98 41.1,23.98 44.09,20.98
44E_H_A
  Top 0.203: U5.14 36.83,32.92 36.04,32.13 36.04,30.79 37.24,29.59 37.24,26.19 36.88,25.83 36.88,24.5 U6.12
44E_H_B
  Top 0.203: U5.11 34.34,33.09 34.34,31.75 36.83,29.26 36.83,26.31 35.13,24.61 35.13,22.66 U6.10
44E_L_A  (via drill 0.3)
  Top 0.203: U5.15 38.43,36.19 38.43,35.69 38.08,35.33 v38.05,35.33 | v24.56,27.66 23.82,28.4 23.82,30.53 U4.19
  Bottom 0.203: v38.05,35.33 36.12,33.4 36.12,32.21 35.66,31.75 35.18,31.75 31.09,27.66 v24.56,27.66
44E_L_B  (via drill 0.3)
  Top 0.203: U5.12 35.07,34.2 35.79,33.48 35.79,33.07 v35.28,32.56 | v25.32,28.27 24.26,29.34 24.26,30.28 24.75,30.77 U4.18
  Bottom 0.203: v35.28,32.56 30.99,28.27 v25.32,28.27
44E_S_B
  Top 0.203: R8.1 40.7,28.16 39.95,27.41 | 39.95,27.41 39.95,26.29 41.91,24.33 41.91,23.22 40.16,21.46 38.12,21.46 U6.11 | C18.1 41.16,31.33 39.95,30.12 39.95,27.41
  Top 0.406: 44E_B.3 41.49,31.11 C18.1
BAT+
  Top 0.203: BAT.1 26.85,11.46 29.18,13.79 29.18,15 R12.1
  Top 0.406: S1.3 23.45,8.04 BAT.1
BLE_EN  (via drill 0.3)
  Top 0.203: U4.14 26.2,29.35 26.85,30 27.2,30 27.48,29.72 27.48,29.16 27.05,28.73 27.05,27.76 27.38,27.43 29.46,27.43 v36.8,20.09
  Bottom 0.203: v36.8,20.09 41.55,20.09 44.81,16.84 44.81,10.44 BLE.1
BLE_STATE  (via drill 0.3)
  Top 0.203: v27.48,25.55 27.16,25.55 U4.11
  Bottom 0.203: BLE.6 42.65,25.55 28.8,25.55 28.57,25.78 27.99,25.78 27.76,25.55 v27.48,25.55
CLK_16M
  Top 0.203: OS1.3 26.02,22.45 U4.5
D+
  Top 0.203: U3.4 12.15,13.47 11.48,12.8 4.98,12.8 4.01,11.84 4.01,8.08 5.74,6.35 JP1.D+ 10.08,6.35 10.31,6.12 10.31,5.51 11.3,4.52 12.9,4.52 13.28,4.14 13.28,2.87 13.66,2.49 15.9,2.49 16.2,2.18 16.2,1.46 U2.2
D-
  Top 0.203: U3.5 12.53,13.12 11.53,12.12 10.72,12.12 10.41,11.81 10.41,9.68 9.35,8.61 6.25,8.61 5.99,8.36 5.99,7.42 6.25,7.16 8.07,7.16 JP1.D- 10.38,7.15 10.82,6.71 10.82,5.54 11.25,5.11 15.57,5.11 16.18,4.5 U2.3
ESP_CHPD
  Top 0.203: ESP.3 10.34,45.09 11.63,46.38 13.44,46.38 13.95,45.87 13.95,41.71 19.48,36.17 19.48,33.94 U4.25
ESP_GPIO0
  Top 0.203: ESP.6 12.7,47.75 11.43,49.02 6.81,49.02 5.77,47.98 5.77,43.43 8.18,41.02 12.37,41.02 16.03,37.36 16.03,35.27 U4.28
ESP_GPIO2  (via drill 0.3)
  Top 0.203: ESP.4 10.16,47.6 8.91,46.35 8.91,43.33 10.82,41.43 12.75,41.43 16.76,37.41 16.76,36.78 v16.79,36.75 | v18.29,34.85 18.29,34.42 U4.26
  Bottom 0.203: v16.79,36.75 16.79,36.35 v18.29,34.85
ESP_GPIO16
  Top 0.203: ESP.5 12.7,42.19 17.6,37.29 17.6,35.76 17.37,35.53 17.37,34.63 U4.27
GND  (via drill 0.3)
  Top 0.203: U4.47 19.74,22.91 19.74,22.5 19.02,21.79 19.02,21.16 SJ3.3
  other vias: 32,22.02 24,26.54 21.62,25.68 24.66,22.15 21.59,22.53 20.75,17.58 18.36,17.53 21.77,15.47 1.98,7.72 1.93,4.88 31.88,6.1 35.51,6.07 45.14,5.54 43.31,15.19 43.28,13.36 42.42,32.99 48.06,33.63 42.6,38.07 31.24,41.99 29.49,40.34 25.27,38.35 22.17,39.52 2.08,42.7 4.09,42.65 7.8,39.04 6.58,30.84 26.75,21.18 27.15,16.89 9.96,17.55 10.57,8.79 9.86,15.9 12.14,20.93 5.18,13.72 11.46,43.15 5.18,11.18 21.95,9.91 29.06,9.65 20.93,3.3 38.23,32.77 38.23,30.73 30.86,30.73 43.05,28.96
  pour Bottom: -2.46,56.74 51.36,56.74 51.36,-2.26 -2.46,-2.26
  pour Top: -0.89,51.64 58.72,51.64 58.72,-1.09 -0.89,-1.09
N$1
  Top 0.203: JP1.GND 10.44,4.75 11.79,3.4 12.41,3.4 R1.1
N$2
  Top 0.203: U3.11 15.76,13.47 16.54,12.7 17.57,12.7 R3.1
N$3
  Top 0.406: R4.2 42.61,7.79 43.36,7.04 43.36,4.39 D1.C
N$4
  Top 0.203: D2.C 23.5,22.15 U4.1
N$5
  Top 0.203: R12.2 R11.1 31.11,20.93 25.87,26.17 U4.10
N$6  (via drill 0.3)
  Top 0.203: U4.9 27.84,23.47 27.84,22.81 v28.68,21.97 | v31.88,18.8 32.82,17.86 32.82,17.16 C8.1
  Top 0.406: C8.1 C9.1 C10.1 L1.1
  Bottom 0.203: v28.68,21.97 28.7,21.97 v31.88,18.8
N$7
  Top 0.203: U4.44 19.1,24.4 16.51,21.82 R6.2
N$8  (via drill 0.3)
  Top 0.203: D6.A 1.68,30.61 v2.56,29.72 | v13.87,25.45 13.89,25.45 14.28,25.07 14.73,25.07 15.49,24.31 16.9,24.31 U4.41
  Bottom 0.203: v2.56,29.72 8.76,29.72 13.03,25.45 v13.87,25.45
N$9
  Top 0.203: R6.1 17.13,19.47 17.98,20.32 SJ3.2
N$10
  Top 0.203: U3.9 15.05,12.77 15.95,11.86 15.95,10.24 16.48,9.7 SJ1.1 19.45,9.71 R2.1
N$11
  Top 0.203: OS1.1 27.62,18.2 28.47,19.05 SJ2.2
N$12  (via drill 3.1)
  other vias: 46.99,2.54
N$13  (via drill 0.3)
  Top 0.203: D5.A 1.68,34.57 v2.54,33.71 | v14.76,26.16 16.03,24.89 16.77,24.89 U4.40
  Bottom 0.203: v2.54,33.71 5.41,33.71 12.95,26.16 v14.76,26.16
N$14
  Top 0.203: R7.1 40.52,36.41 39.81,35.7 | 39.81,35.7 39.75,35.64 39.75,30.63 39.4,30.28 39.4,27.84 37.97,26.42 37.97,25.21 U6.13 | C17.1 41.16,41.49 39.75,40.08 39.75,35.76 39.81,35.7
  Top 0.406: 44E_A.3 41.49,41.27 C17.1
N$15
  Top 0.203: U3.6 12.89,12.77 11.94,11.81 11.94,11.14 C5.1
N$16  (via drill 0.3)
  Top 0.203: D4.A 1.68,38.38 v2.54,37.52 | v15.37,26.85 15.37,26.54 16.36,25.55 16.73,25.55 U4.39
  Bottom 0.203: v2.54,37.52 2.54,37.34 12.93,26.95 15.27,26.95 v15.37,26.85
N$17
  Top 0.203: D4.C 4.67,38.2 5.74,37.13 5.74,36.58 6.35,35.97 R9.2
N$18
  Top 0.203: D5.C 5.97,35.56 6.35,35.18 6.98,35.18 R9.3
N$19
  Top 0.203: D6.C 4.67,32.54 6.48,34.34 6.98,34.34 R9.4
N$20
  Top 0.406: S1.2 20.95,6.43 21.79,5.59 25.72,5.59 C16.1 27.87,5.14 C1.A 29.69,5.84 30.1,5.44 30.1,1.22 30.58,0.74 35.28,0.74 35.97,1.42 U1.3
N$21  (via drill 3.1)
  other vias: 46.99,46.99
N$22  (via drill 3.1)
  other vias: 2.54,46.99
N$23  (via drill 3.1)
  other vias: 2.54,15.24
N$48  (via drill 0.3)
  Top 0.203: R5.2 25.4,35.79 v25.76,36.14
  Bottom 0.203: v25.76,36.14 27.25,36.14 SJ14.2
NRF_CE  (via drill 0.3)
  Top 0.203: U4.33 17.74,30.06 18.41,29.39 18.41,28.91 20.02,27.3 20.04,27.3 20.42,26.92 21.82,26.92 v21.87,26.98 | v28.91,33.35 29.82,33.35 36.85,40.39 36.85,45.06 NRF.3
  Bottom 0.203: v21.87,26.98 22.53,26.98 v28.91,33.35
NRF_CSN  (via drill 0.3)
  Top 0.203: U4.32 18.07,30.41 18.85,29.64 18.85,29.03 20.24,27.64 20.9,27.64 v21.08,27.81 | v27.86,33.48 27.96,33.48 28.63,34.14 29.95,34.14 36.27,40.46 36.27,43.74 35.61,44.4 35.61,46.41 NRF.4
  Bottom 0.203: v21.08,27.81 22.58,27.81 27.15,32.38 27.15,32.77 v27.86,33.48
NRF_IRQ  (via drill 0.3)
  Top 0.203: U4.29 19.11,31.46 v21.54,29.03
  Bottom 0.203: v21.54,29.03 23.09,29.03 26.77,32.72 26.77,33.53 27.18,33.93 27.3,33.93 27.74,34.37 33.4,34.37 43.64,44.6 43.64,45.9 NRF.8
NRST  (via drill 0.3)
  Top 0.203: U4.7 24.8,25.11 v25.76,24.16 | v28.75,24.16 28.78,24.16 34.01,18.92 34.04,18.92 34.72,18.24 35.53,18.24 36.2,17.58 C7.2 37.12,15.46 38.1,16.43 S2.3
  Bottom 0.203: v25.76,24.16 v28.75,24.16
OURET
  Top 0.203: R5.1 25.4,32.81 U4.20
SPI1_MISO  (via drill 0.3)
  Top 0.203: v38.23,41.25 38.23,40.36 29.95,32.08 27.5,32.08 U4.16
  Bottom 0.203: NRF.7 41.91,44.93 v38.23,41.25
SPI1_MOSI
  Top 0.203: NRF.6 39.37,47.07 38.18,45.87 38.18,42.37 37.57,41.76 37.57,40.44 29.77,32.64 27.35,32.64 U4.17
SPI1_SCK
  Top 0.203: NRF.5 39.37,40.87 30.05,31.55 27.67,31.55 U4.15
SWCLK  (via drill 0.3)
  Top 0.203: SL.4 28.57,43.74 26.85,42.01 19.99,42.01 v19.96,41.99 | v17.73,27.99 17.73,27.97 U4.37
  Bottom 0.203: v19.96,41.99 19.66,41.99 15.88,38.2 15.88,34.67 18.21,32.33 18.21,28.47 v17.73,27.99
SWDIO  (via drill 0.3)
  Top 0.203: SL.3 26.04,47.62 24.74,46.33 24.74,43.61 24.21,43.08 v19.56,43.08 | v16.76,32.23 16.76,30.29 U4.34
  Bottom 0.203: v19.56,43.08 19.41,43.08 15.01,38.68 15.01,34.54 16.79,32.77 16.79,32.26 v16.76,32.23
TIM4_CH1  (via drill 0.3)
  Top 0.203: v13.01,24.64 14.55,24.64 15.27,23.93 17.22,23.93 U4.42
  Bottom 0.203: M1.3 10.21,27.43 v13.01,24.64
TIM4_CH2  (via drill 0.3)
  Top 0.203: U4.43 17.45,23.44 14.99,23.44 14.76,23.67 14.02,23.67 13.79,23.44 v12.98,23.44
  Bottom 0.203: M2.3 11.53,24.89 v12.98,23.44
TIM4_CH3  (via drill 0.3)
  Top 0.203: v18.19,22.53 18.19,22.77 U4.45
  Bottom 0.203: v18.19,22.53 17.58,21.95 7.39,21.95 M3.3
TIM4_CH4  (via drill 0.3)
  Top 0.203: v19.07,22.76 19.25,23.13 U4.46
  Bottom 0.203: M4.3 16.76,19.81 18.62,21.67 18.62,21.89 19.07,22.35 v19.07,22.76
USART1_RX  (via drill 0.3)
  Top 0.203: U3.26 11.18,17.32 11.18,18.19 13.64,20.65 13.64,22.12 v14.38,22.86 | v19.48,29.46 19.48,29.7 U4.31
  Bottom 0.203: v14.38,22.86 14.38,22.89 15.65,24.16 17.48,24.16 19.48,26.16 v19.48,29.46 20.95,30.99 UART.1
USART1_TX  (via drill 0.3)
  Top 0.203: U3.25 12.18,17.01 11.63,17.55 11.63,17.98 14.15,20.5 14.15,21.23 v15.52,22.61 | v20.32,28.96 20.32,29.56 U4.30
  Bottom 0.203: v15.52,22.61 15.52,22.66 16.48,23.62 17.68,23.62 19.91,25.86 19.91,28.52 v20.32,28.96 23.5,32.13 UART.2
USART2_RX
  Top 0.203: U4.13 26.54,27.59 27.1,27.03 28.07,27.03 36.02,19.07 44.04,19.07 BLE.4
USART2_TX  (via drill 0.3)
  Top 0.203: v28.27,24.99 28.27,26.01 27.84,26.44 26.98,26.44 U4.12
  Bottom 0.203: BLE.5 47.62,17.8 45.95,19.48 45.95,21.54 42.49,24.99 v28.27,24.99
USART3_RX  (via drill 0.3)
  Top 0.203: ESP.1 7.62,43.03 v8.43,42.22 | v16.61,42.24 17.07,42.24 18.26,41.05 18.67,41.05 23.9,35.81 23.9,32.73 U4.22
  Bottom 0.203: v8.43,42.22 16.59,42.22 v16.61,42.24
USART3_TX
  Top 0.203: ESP.8 16.33,47.62 17.73,46.23 17.73,42.67 24.36,36.04 24.36,32.48 U4.21
VBUS  (via drill 0.3)
  Top 0.203: 13.12,12.27 13.12,9.27 R10.2 | C3.2 C4.2 8.65,15.03 v9.91,13.77 | v13.99,11.76 13.99,12.29 14.12,12.41 | 12.06,6.99 12.06,6.36 D3.A
  Top 0.305: 13.12,12.27 U3.7 14.12,12.41 U3.8
  Top 0.406: JP1.VBUS 11.09,7.96 12.06,6.99 12.06,7.83 R10.2
  Bottom 0.203: v9.91,13.77 9.91,13.74 11.89,11.76 v13.99,11.76

### Text on the board
tNames: GND | GND | 3.3 | GND | DIO | CLK | RX | TX | GND | PJ10 | + | GND | + | GND | + | POWER
bNames: Oct 30 2015 | Rijn